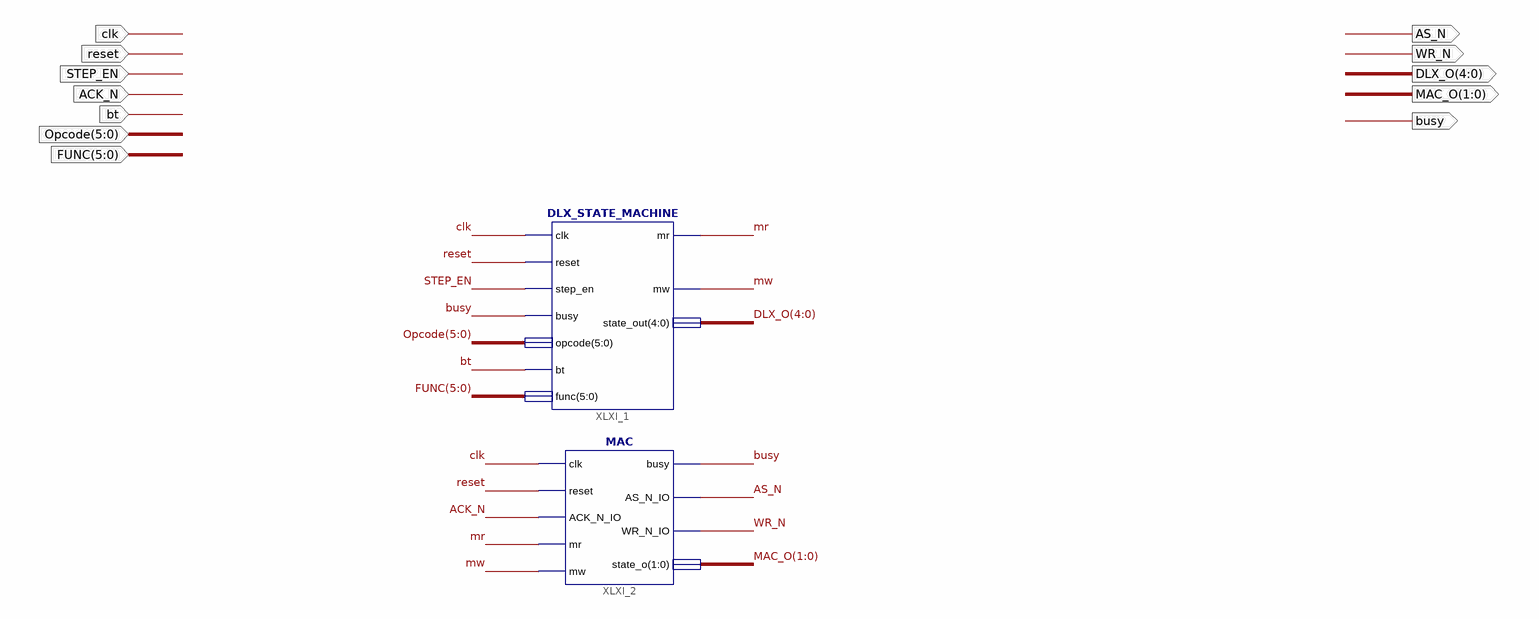
[diagram p0: schematic sheet 1]
// Xilinx ISE schematic DLX_Control_Module.sch (spartan6) as structural Verilog: 2 symbols, 12 ports
module DLX_Control_Module (
  input  STEP_EN,
  input  clk,
  input  reset,
  input  ACK_N,
  input  bt,
  input  [5:0] Opcode,
  input  [5:0] FUNC,
  output busy,
  output AS_N,
  output WR_N,
  output [1:0] MAC_O,
  output [4:0] DLX_O
);

  wire mr, mw;

  DLX_STATE_MACHINE XLXI_1 (
    .clk(clk), .reset(reset), .step_en(STEP_EN), .busy(busy), .bt(bt), .opcode(Opcode), .func(FUNC), .mr(mr),
    .mw(mw), .state_out(DLX_O));
  MAC XLXI_2 (
    .clk(clk), .reset(reset), .ACK_N_IO(ACK_N), .mr(mr), .mw(mw), .busy(busy), .AS_N_IO(AS_N),
    .WR_N_IO(WR_N), .state_o(MAC_O));
endmodule
